# EAGLE design stepper control stm32 (EAGLE 9.6.2)
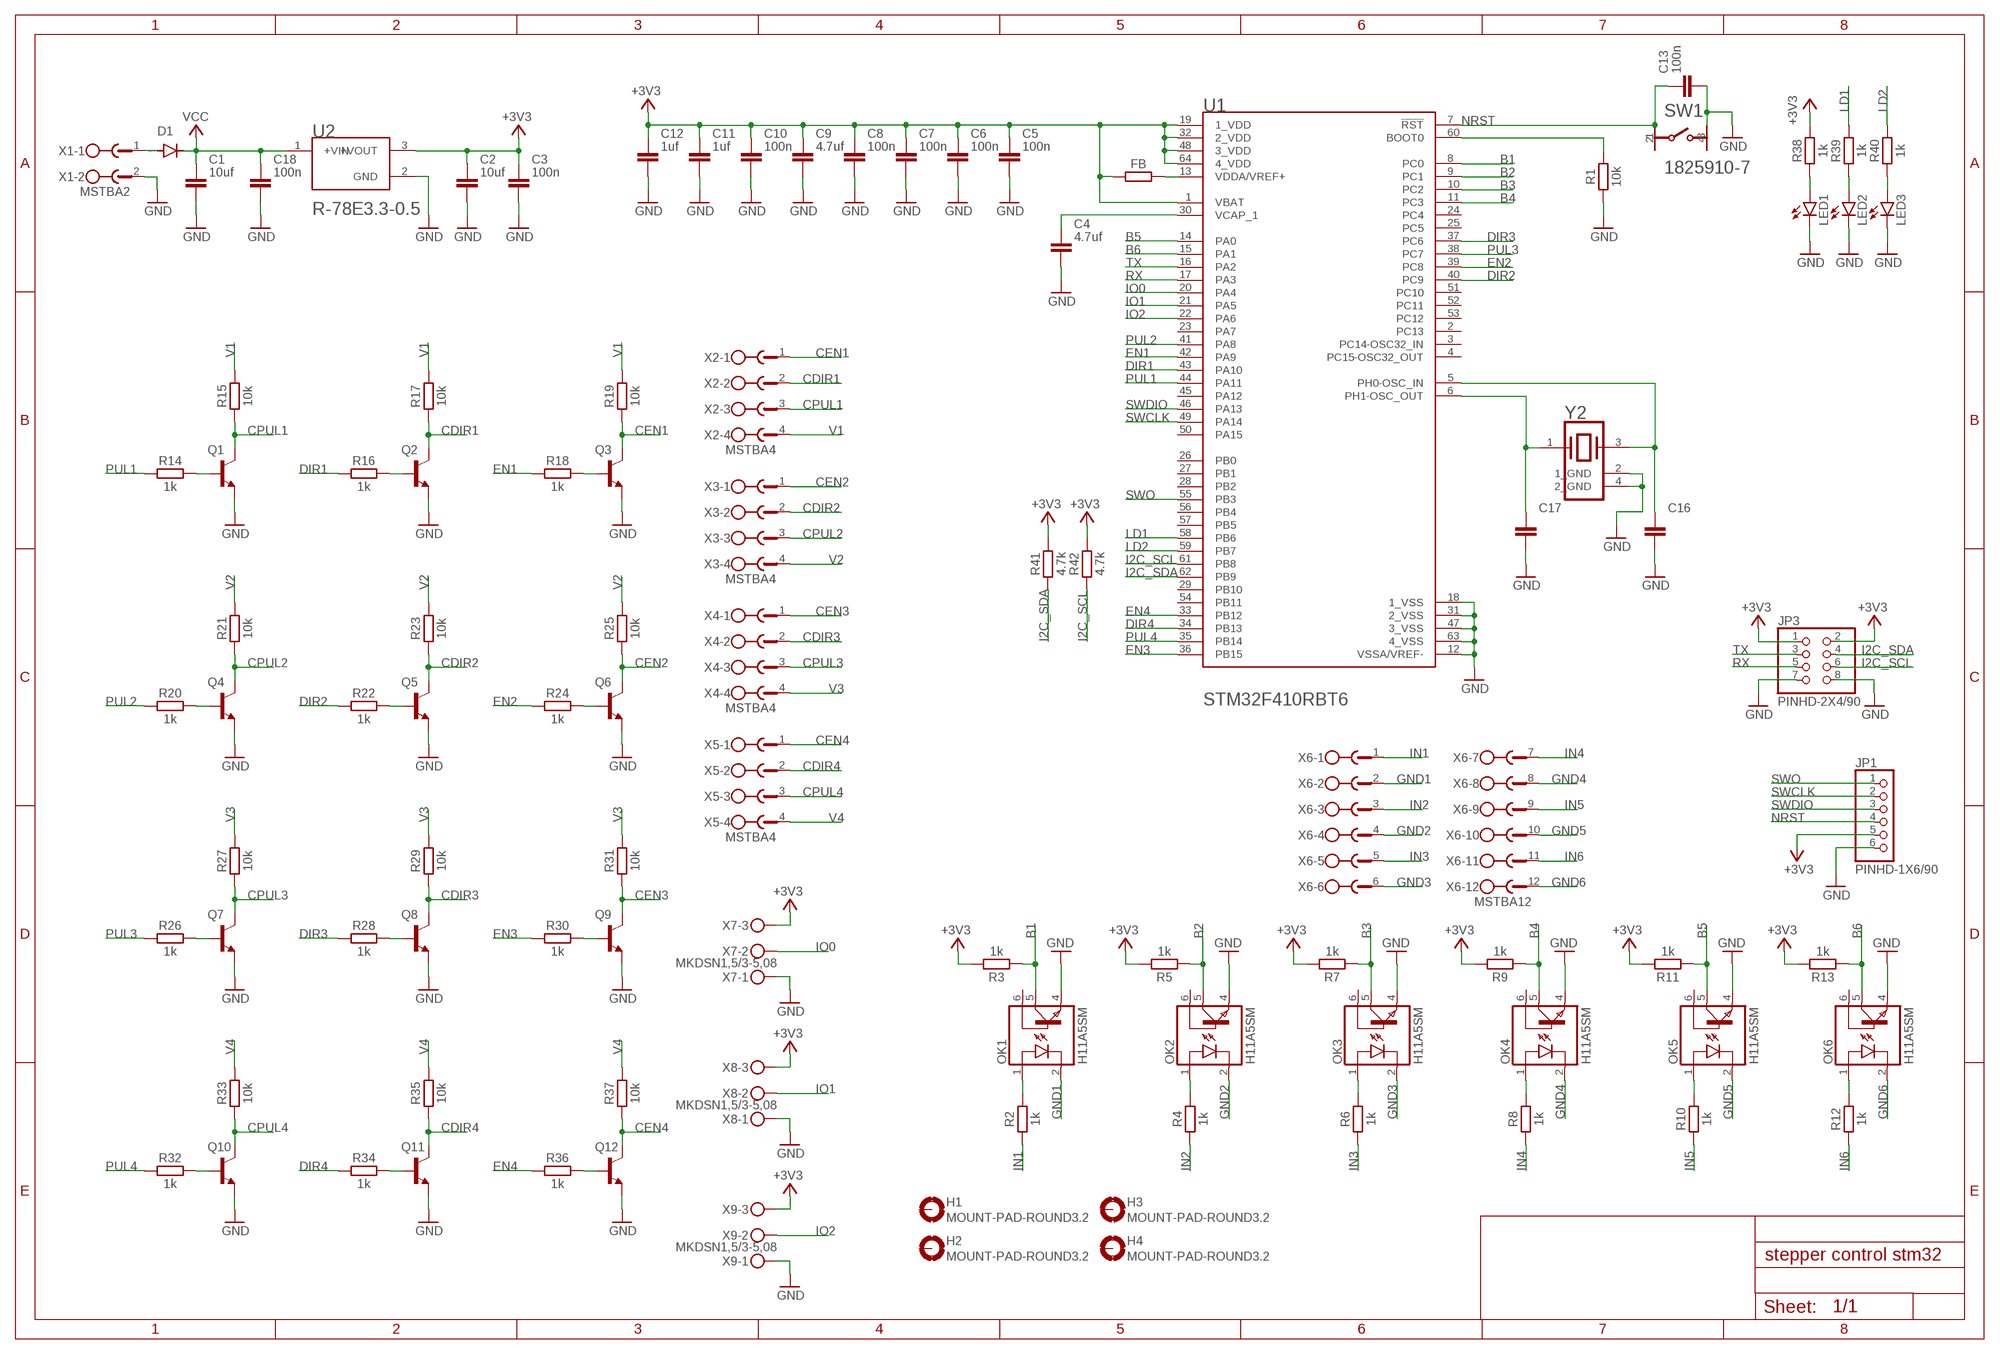
[diagram p0: schematic, sheet 1]

## Parts
C1  10uf  C_CHIP-0805(2012-METRIC)  [CAPC2012X110]
C2  10uf  C_CHIP-0805(2012-METRIC)  [CAPC2012X110]
C3  100n  C_CHIP-0603(1608-METRIC)  [CAPC1608X85]
C4  4.7uf  C_CHIP-1206(3216-METRIC)  [CAPC3216X135]
C5  100n  C_CHIP-0603(1608-METRIC)  [CAPC1608X85]
C6  100n  C_CHIP-0603(1608-METRIC)  [CAPC1608X85]
C7  100n  C_CHIP-0603(1608-METRIC)  [CAPC1608X85]
C8  100n  C_CHIP-0603(1608-METRIC)  [CAPC1608X85]
C9  4.7uf  C_CHIP-1206(3216-METRIC)  [CAPC3216X135]
C10  100n  C_CHIP-0603(1608-METRIC)  [CAPC1608X85]
C11  1uf  C_CHIP-0603(1608-METRIC)  [CAPC1608X85]
C12  1uf  C_CHIP-0603(1608-METRIC)  [CAPC1608X85]
C13  100n  C_CHIP-0603(1608-METRIC)  [CAPC1608X85]
C16  C_CHIP-0603(1608-METRIC)  [CAPC1608X85]
C17  C_CHIP-0603(1608-METRIC)  [CAPC1608X85]
C18  100n  C_CHIP-0603(1608-METRIC)  [CAPC1608X85]
D1  DIODE-SOD123  [SOD123]
FB  R_CHIP-0402(1005-METRIC)  [RESC1005X40]
H1  MOUNT-PAD-ROUND3.2  [3,2-PAD]
H2  MOUNT-PAD-ROUND3.2  [3,2-PAD]
H3  MOUNT-PAD-ROUND3.2  [3,2-PAD]
H4  MOUNT-PAD-ROUND3.2  [3,2-PAD]
JP1  PINHD-1X6/90  [1X06/90]
JP3  PINHD-2X4/90  [2X04/90]
LED1  LEDCHIPLED_0805  [CHIPLED_0805]
LED2  LEDCHIPLED_0805  [CHIPLED_0805]
LED3  LEDCHIPLED_0805  [CHIPLED_0805]
OK1  H11A5SM  [DIL6-SMD]
OK2  H11A5SM  [DIL6-SMD]
OK3  H11A5SM  [DIL6-SMD]
OK4  H11A5SM  [DIL6-SMD]
OK5  H11A5SM  [DIL6-SMD]
OK6  H11A5SM  [DIL6-SMD]
Q1  MMBT3904LT1G  [SOT23-3]
Q2  MMBT3904LT1G  [SOT23-3]
Q3  MMBT3904LT1G  [SOT23-3]
Q4  MMBT3904LT1G  [SOT23-3]
Q5  MMBT3904LT1G  [SOT23-3]
Q6  MMBT3904LT1G  [SOT23-3]
Q7  MMBT3904LT1G  [SOT23-3]
Q8  MMBT3904LT1G  [SOT23-3]
Q9  MMBT3904LT1G  [SOT23-3]
Q10  MMBT3904LT1G  [SOT23-3]
Q11  MMBT3904LT1G  [SOT23-3]
Q12  MMBT3904LT1G  [SOT23-3]
R1  10k  R_CHIP-0603(1608-METRIC)  [RESC1608X60]
R2  1k  R_CHIP-0603(1608-METRIC)  [RESC1608X60]
R3  1k  R_CHIP-0603(1608-METRIC)  [RESC1608X60]
R4  1k  R_CHIP-0603(1608-METRIC)  [RESC1608X60]
R5  1k  R_CHIP-0603(1608-METRIC)  [RESC1608X60]
R6  1k  R_CHIP-0603(1608-METRIC)  [RESC1608X60]
R7  1k  R_CHIP-0603(1608-METRIC)  [RESC1608X60]
R8  1k  R_CHIP-0603(1608-METRIC)  [RESC1608X60]
R9  1k  R_CHIP-0603(1608-METRIC)  [RESC1608X60]
R10  1k  R_CHIP-0603(1608-METRIC)  [RESC1608X60]
R11  1k  R_CHIP-0603(1608-METRIC)  [RESC1608X60]
R12  1k  R_CHIP-0603(1608-METRIC)  [RESC1608X60]
R13  1k  R_CHIP-0603(1608-METRIC)  [RESC1608X60]
R14  1k  R_CHIP-0603(1608-METRIC)  [RESC1608X60]
R15  10k  R_CHIP-0603(1608-METRIC)  [RESC1608X60]
R16  1k  R_CHIP-0603(1608-METRIC)  [RESC1608X60]
R17  10k  R_CHIP-0603(1608-METRIC)  [RESC1608X60]
R18  1k  R_CHIP-0603(1608-METRIC)  [RESC1608X60]
R19  10k  R_CHIP-0603(1608-METRIC)  [RESC1608X60]
R20  1k  R_CHIP-0603(1608-METRIC)  [RESC1608X60]
R21  10k  R_CHIP-0603(1608-METRIC)  [RESC1608X60]
R22  1k  R_CHIP-0603(1608-METRIC)  [RESC1608X60]
R23  10k  R_CHIP-0603(1608-METRIC)  [RESC1608X60]
R24  1k  R_CHIP-0603(1608-METRIC)  [RESC1608X60]
R25  10k  R_CHIP-0603(1608-METRIC)  [RESC1608X60]
R26  1k  R_CHIP-0603(1608-METRIC)  [RESC1608X60]
R27  10k  R_CHIP-0603(1608-METRIC)  [RESC1608X60]
R28  1k  R_CHIP-0603(1608-METRIC)  [RESC1608X60]
R29  10k  R_CHIP-0603(1608-METRIC)  [RESC1608X60]
R30  1k  R_CHIP-0603(1608-METRIC)  [RESC1608X60]
R31  10k  R_CHIP-0603(1608-METRIC)  [RESC1608X60]
R32  1k  R_CHIP-0603(1608-METRIC)  [RESC1608X60]
R33  10k  R_CHIP-0603(1608-METRIC)  [RESC1608X60]
R34  1k  R_CHIP-0603(1608-METRIC)  [RESC1608X60]
R35  10k  R_CHIP-0603(1608-METRIC)  [RESC1608X60]
R36  1k  R_CHIP-0603(1608-METRIC)  [RESC1608X60]
R37  10k  R_CHIP-0603(1608-METRIC)  [RESC1608X60]
R38  1k  R_CHIP-0603(1608-METRIC)  [RESC1608X60]
R39  1k  R_CHIP-0603(1608-METRIC)  [RESC1608X60]
R40  1k  R_CHIP-0603(1608-METRIC)  [RESC1608X60]
R41  4.7k  R_CHIP-0603(1608-METRIC)  [RESC1608X60]
R42  4.7k  R_CHIP-0603(1608-METRIC)  [RESC1608X60]
SW1  TE_1825910-7TE_1825910-7_0_0  [TE_1825910-7_0]
U1  STMICROELECTRONICS_STM32F410RBT6STMICROELECTRONICS_STM32F410RBT6_0_1  [STMICROELECTRONICS_STM32F410RBT6_1]
U2  RECOM_R-78E3.3-0.5RECOM_R-78E3.3-0.5_0_0  [RECOM_R-78E3.3-0.5_0]
X1  MSTBA2  [MSTBA2]
X2  MSTBA4  [MSTBA4]
X3  MSTBA4  [MSTBA4]
X4  MSTBA4  [MSTBA4]
X5  MSTBA4  [MSTBA4]
X6  MSTBA12  [MSTBA12]
X7  MKDSN1,5/3-5,08  [MKDSN1,5/3-5,08]
X8  MKDSN1,5/3-5,08  [MKDSN1,5/3-5,08]
X9  MKDSN1,5/3-5,08  [MKDSN1,5/3-5,08]
Y2  ABRACON_ABM8G-25.000MHZ-18-D2Y-TABRACON_ABM8G-25.000MHZ-18-D2Y-T_0_0  [ABRACON_ABM8G-25.000MHZ-18-D2Y-T_0]

## Nets
+3V3: C2.1 C3.1 C5.1 C6.1 C7.1 C8.1 C9.1 C10.1 C11.1 C12.1 FB.1 JP1.5 JP3.1 JP3.2 R3.2 R5.2 R7.2 R9.2 R11.2 R13.2 R38.2 R41.2 R42.2 U1.1(VBAT) U1.19(1_VDD) U1.32(2_VDD) U1.48(3_VDD) U1.64(4_VDD) U2.3(+VOUT) X7.3 X8.3 X9.3
B1: OK1.5(COL) R3.1 U1.8(PC0)
B2: OK2.5(COL) R5.1 U1.9(PC1)
B3: OK3.5(COL) R7.1 U1.10(PC2)
B4: OK4.5(COL) R9.1 U1.11(PC3)
B5: OK5.5(COL) R11.1 U1.14(PA0)
B6: OK6.5(COL) R13.1 U1.15(PA1)
CDIR1: Q2.3(C) R17.1 X2.2
CDIR2: Q5.3(C) R23.1 X3.2
CDIR3: Q8.3(C) R29.1 X4.2
CDIR4: Q11.3(C) R35.1 X5.2
CEN1: Q3.3(C) R19.1 X2.1
CEN2: Q6.3(C) R25.1 X3.1
CEN3: Q9.3(C) R31.1 X4.1
CEN4: Q12.3(C) R37.1 X5.1
CPUL1: Q1.3(C) R15.1 X2.3
CPUL2: Q4.3(C) R21.1 X3.3
CPUL3: Q7.3(C) R27.1 X4.3
CPUL4: Q10.3(C) R33.1 X5.3
DIR1: R16.1 U1.43(PA10)
DIR2: R22.1 U1.40(PC9)
DIR3: R28.1 U1.37(PC6)
DIR4: R34.1 U1.34(PB13)
EN1: R18.1 U1.42(PA9)
EN2: R24.1 U1.39(PC8)
EN3: R30.1 U1.36(PB15)
EN4: R36.1 U1.33(PB12)
GND: C1.2 C2.2 C3.2 C4.2 C5.2 C6.2 C7.2 C8.2 C9.2 C10.2 C11.2 C12.2 C13.2 C16.2 C17.2 C18.2 JP1.6 JP3.7 JP3.8 LED1.C LED2.C LED3.C OK1.4(EMI) OK2.4(EMI) OK3.4(EMI) OK4.4(EMI) OK5.4(EMI) OK6.4(EMI) Q1.2(E) Q2.2(E) Q3.2(E) Q4.2(E) Q5.2(E) Q6.2(E) Q7.2(E) Q8.2(E) Q9.2(E) Q10.2(E) Q11.2(E) Q12.2(E) R1.1 SW1.3 U1.12(VSSA/VREF-) U1.18(1_VSS) U1.31(2_VSS) U1.47(3_VSS) U1.63(4_VSS) U2.2(GND) X1.2 X7.1 X8.1 X9.1 Y2.2(1_GND) Y2.4(2_GND)
GND1: OK1.2(C) X6.2
GND2: OK2.2(C) X6.4
GND3: OK3.2(C) X6.6
GND4: OK4.2(C) X6.8
GND5: OK5.2(C) X6.10
GND6: OK6.2(C) X6.12
I2C_SCL: JP3.6 R42.1 U1.61(PB8)
I2C_SDA: JP3.4 R41.1 U1.62(PB9)
IN1: R2.1 X6.1
IN2: R4.1 X6.3
IN3: R6.1 X6.5
IN4: R8.1 X6.7
IN5: R10.1 X6.9
IN6: R12.1 X6.11
IO0: U1.20(PA4) X7.2
IO1: U1.21(PA5) X8.2
IO2: U1.22(PA6) X9.2
LD1: R39.2 U1.58(PB6)
LD2: R40.2 U1.59(PB7)
N$1: FB.2 U1.13(VDDA/VREF+)
N$2: C4.1 U1.30(VCAP_1)
N$4: R1.2 U1.60(BOOT0)
N$6: C16.1 U1.5(PH0-OSC_IN) Y2.3
N$7: C17.1 U1.6(PH1-OSC_OUT) Y2.1
N$8: OK1.1(A) R2.2
N$9: Q1.1(B) R14.2
N$10: LED3.A R40.1
N$11: LED2.A R39.1
N$12: OK2.1(A) R4.2
N$13: Q10.1(B) R32.2
N$14: Q2.1(B) R16.2
N$15: LED1.A R38.1
N$16: OK3.1(A) R6.2
N$17: D1.A X1.1
N$19: Q3.1(B) R18.2
N$20: OK4.1(A) R8.2
N$24: OK5.1(A) R10.2
N$25: Q4.1(B) R20.2
N$28: OK6.1(A) R12.2
N$30: Q5.1(B) R22.2
N$33: Q11.1(B) R34.2
N$34: Q6.1(B) R24.2
N$38: Q7.1(B) R26.2
N$42: Q8.1(B) R28.2
N$46: Q9.1(B) R30.2
N$49: Q12.1(B) R36.2
NRST: C13.1 JP1.4 SW1.1 U1.7(!RST!)
PUL1: R14.1 U1.44(PA11)
PUL2: R20.1 U1.41(PA8)
PUL3: R26.1 U1.38(PC7)
PUL4: R32.1 U1.35(PB14)
RX: JP3.5 U1.17(PA3)
SWCLK: JP1.2 U1.49(PA14)
SWDIO: JP1.3 U1.46(PA13)
SWO: JP1.1 U1.55(PB3)
TX: JP3.3 U1.16(PA2)
V1: R15.2 R17.2 R19.2 X2.4
V2: R21.2 R23.2 R25.2 X3.4
V3: R27.2 R29.2 R31.2 X4.4
V4: R33.2 R35.2 R37.2 X5.4
VCC: C1.1 C18.1 D1.C U2.1(+VIN)
Unconnected: H1.B3,2(MOUNT) H2.B3,2(MOUNT) H3.B3,2(MOUNT) H4.B3,2(MOUNT) OK1.6(BAS) OK2.6(BAS) OK3.6(BAS) OK4.6(BAS) OK5.6(BAS) OK6.6(BAS) SW1.2 SW1.4 U1.2(PC13) U1.3(PC14-OSC32_IN) U1.4(PC15-OSC32_OUT) U1.23(PA7) U1.24(PC4) U1.25(PC5) U1.26(PB0) U1.27(PB1) U1.28(PB2) U1.29(PB10) U1.45(PA12) U1.50(PA15) U1.51(PC10) U1.52(PC11) U1.53(PC12) U1.54(PB11) U1.56(PB4) U1.57(PB5)

## Library data of the parts
C1-C13 C16-C18 = Capacitor:C: Capacitor - Generic; CATEGORY: Capacitor
D1 = diode:DIODE-: DIODE
FB R1-R42 = Resistor:R: Resistor Fixed - Generic; CATEGORY: Resistor; SUB-CATEGORY: Fixed
H1-H4 = holes:MOUNT-PAD-ROUND: MOUNTING PAD, round
JP1 = Connector:PINHD-1X6: PIN HEADER; CATEGORY: CONNECTOR; SUB-CATEGORY: PIN-HEADER
JP3 = Connector:PINHD-2X4: PIN HEADER; CATEGORY: CONNECTOR; SUB-CATEGORY: PIN-HEADER
LED1-LED3 = led:LED: LED OSRAM: - CHIPLED LG R971, LG N971, LY N971, LG Q971, LY Q971, LO R971, LY R971 LH N974, LH R974 LS Q976, LO Q976, LY Q976 LO Q996 - Hyper CHIPLED LW Q18S LB Q993, LB Q99A, LB R99A - SideLED LS A670, LO A670, LY A670, LG A670, LP A670 LB A673, LV A673, LT A673, LW A673 LH A674 LY A675 LS A676, LA A676, LO A676, LY A676, LW A676 LS A679, LY A679, LG A679 - Hyper Micro SIDELED® LS Y876, LA Y876, LO Y876, LY Y876 LT Y87S - SmartLED LW L88C, LW L88S LB L89C, LB L89S, LG L890 LS L89K, LO L89K, LY L89K LS L896, LA L896, LO L896, LY L896 - TOPLED LS T670, LO T670, LY T670, LG T670, LP T670 LSG T670, LSP T670, LSY T670, LOP T670, LYG T670 LG T671, LOG T671, LSG T671 LB T673, LV T673, LT T673, LW T673 LH T674 LS T676, LA T676, LO T676, LY T676, LB T676, LH T676, LSB T676, LW T676 LB T67C, LV T67C, LT T67C, LS T67K, LO T67K, LY T67K, LW E67C LS E67B, LA E67B, LO E67B, LY E67B, LB E67C, LV E67C, LT E67C LW T67C LS T679, LY T679, LG T679 LS T770, LO T770, LY T770, LG T770, LP T770 LB T773, LV T773, LT T773, LW T773 LH T774 LS E675, LA E675, LY E675, LS T675 LS T776, LA T776, LO T776, LY T776, LB T776 LHGB T686 LT T68C, LB T68C - Hyper Mini TOPLED® LB M676 - Mini TOPLED Santana® LG M470 LS M47K, LO M47K, LY M47K Source: http://www.osram.convergy.de LUXEON: - LUMILED® LXK2-PW12-R00, LXK2-PW12-S00, LXK2-PW14-U00, LXK2-PW14-V00 LXK2-PM12-R00, LXK2-PM12-S00, LXK2-PM14-U00 LXK2-PE12-Q00, LXK2-PE12-R00, LXK2-PE12-S00, LXK2-PE14-T00, LXK2-PE14-U00 LXK2-PB12-K00, LXK2-PB12-L00, LXK2-PB12-M00, LXK2-PB14-N00, LXK2-PB14-P00, LXK2-PB14-Q00 LXK2-PR12-L00, LXK2-PR12-M00, LXK2-PR14-Q00, LXK2-PR14-R00 LXK2-PD12-Q00, LXK2-PD12-R00, LXK2-PD12-S00 LXK2-PH12-R00, LXK2-PH12-S00 LXK2-PL12-P00, LXK2-PL12-Q00, LXK2-PL12-R00 Source: www.luxeon.com KINGBRIGHT: KA-3528ASYC Source: www.kingbright.com
OK1-OK6 = optocoupler:H11A*?M: General Purpose 6-Pin Phototransistor Optocouplers Source: http://www.fairchildsemi.com/ds/4N/4N35-M.pdf; OC_FARNELL: unknown; OC_NEWARK: unknown
Q1-Q12 = Transistor:MMBT3904LT1G: TRANS NPN 40V 0.2A SOT23 Manufacturer's datasheet <https://www.onsemi.com/pub/Collateral/MMBT3904LT1-D.PDF>; CREATED_BY: PCBLayout.com; DIGIKEY_PART_NUMBER: MMBT3904LT1GOSTR-ND; MANUFACTURER: ON Semiconductor; MPN: MMBT3904LT1G; PACKAGE: SOT23-3
SW1 = TE - 1825910-7:TE_1825910-7: 6 MM TACT SWITCH, THRU-HOLE HIGH TEMP; ACTUATOR_HEIGHT_OFF_PCB,_VERTICAL: 5.00mm; ACTUATOR_MATERIAL: Polybutylene Terephthalate (PBT); ACTUATOR_ORIENTATION: Top Actuated; ACTUATOR_TYPE: Standard; CENTROID_NOT_SPECIFIED: No; CIRCUIT: SPST-NO; CONTACT_RATING_@_VOLTAGE: 0.05A @ 24VDC; DATASHEET: http://www.te.com/commerce/DocumentDelivery/DDEController?Action=srchrtrv&DocNm=1825910&DocType=Customer+Drawing&DocLang=English; DIGIKEY_DESCRIPTION: SWITCH Tactile Switch SPST-NO Top Actuated Through Hole; DIGIKEY_PART_NUMBER: 450-1804-ND; ILLUMINATION: Non-Illuminated; LEAD_FREE: yes; MECHANICAL_LIFE: 100,000 Cycles; MF: TE; MOUNTING_TYPE: Through Hole; MOUSER_PART_NUMBER: 506-FSM4JAH; MPN: 1825910-7; OPERATING_FORCE: 260gf; OUTLINE: 6.00mm x 6.00mm; PACKAGE: Through Hole; PREFIX: SW; ROHS: yes; SWITCH_FUNCTION: Off-Mom; SWITCH_TRAVEL: 0.25mm; TEMPERATURE_RANGE_HIGH: +85°C; TEMPERATURE_RANGE_LOW: -35°C; TERMINATION_STYLE: PC Pin
U1 = STMicroelectronics - STM32F410RBT6:STMICROELECTRONICS_STM32F410RBT6: IC MCU 32BIT 128KB FLASH 64LQFP; AMBIENT_TEMPERATURE_RANGE_HIGH: +85°C; AMBIENT_TEMPERATURE_RANGE_LOW: -40°C; AUTOMOTIVE: No; CENTROID_NOT_SPECIFIED: No; CORE_ARCHITECTURE: ARM Cortex-M4; DATASHEET: https://www.st.com/resource/en/datasheet/stm32f410rb.pdf; DATA_BUS_WIDTH: 32bits; DEVICE_CLASS_L1: Integrated Circuits (ICs); DEVICE_CLASS_L2: Embedded Processors and Controllers; DEVICE_CLASS_L3: Microcontrollers; DIGIKEY_DESCRIPTION: IC MCU 32BIT 128KB FLASH 64LQFP; DIGIKEY_PART_NUMBER: 497-16239-ND; FOOTPRINT_PARAMETERS_1: {"fp_type":"TQFP","params":{"N1":{"nom":16,"long name":"Leads on long side","min":null,"max":null,"short name":"N1","type":"count"},"N2":{"nom":16,"long name":"Leads on wide side","min":null,"max":null,"short name":"N2","type":"count"},"A":{"nom":false,"long name":"Height","min":false,"max":1600000,"short name":"A","type":"measurement"},"A1":{"nom":false,"long name":"Package clearance","min":50000,"max":150000,"short name":"A1","type":"measurement"},"A2":{"nom":1400000,"long name":"Package height","min":1350000,"max":1450000,"short name":"A2","type":"measurement"},"D":{"nom":12000000,"long name":"Length /w leads","min":false,"max":false,"short name":"D","type":"measurement"},"D1":{"nom":10000000,"long name":"Package length","min":false,"max":false,"short name":"D1","type":"measurement"},"E":{"nom":12000000,"long name":"Width /w leads","min":false,"max":false,"short name":"E","type":"measurement"},"E1":{"nom":10000000,"long name":"Package width","min":false,"max":false,"short name":"E1","type":"measurement"},"B":{"nom":220000,"long name":"Lead width","min":170000,"max":270000,"short name":"B","type":"measurement"},"C":{"nom":false,"long name":"Lead thickness","min":90000,"max":200000,"short name":"C","type":"measurement"},"L":{"nom":600000,"long name":"Lead foot length","min":450000,"max":750000,"short name":"L","type":"measurement"},"e":{"nom":500000,"long name":"Lead pitch","min":null,"max":null,"short name":"e","type":"measurement"},"PHI":{"nom":false,"long name":"Lead angle","min":0,"max":7000000,"short name":"PHI","type":"measurement"},"HT":{"default":"No","long name":"Thermal pad","type":"multichoiceparent","short name":"HT","children":[]},"offset x":{"nom":0,"long name":"X Center offset","min":null,"max":null,"short name":"offset x","type":"measurement"},"offset y":{"nom":0,"long name":"Y Center offset","min":null,"max":null,"short name":"offset y","type":"measurement"},"LS":{"default":"Rounded rectangle","long name":"Land shape","type":"multichoice","short name":"LS"},"LS1":{"default":"Rectangle","long name":"Land shape (Pin 1)","type":"multichoice","short name":"LS1"},"solder toe":{"nom":550000,"long name":"Solder fillet (toe)","min":null,"max":null,"short name":"solder toe","type":"fixedmeasurement"},"solder heel":{"nom":450000,"long name":"Solder fillet (heel)","min":null,"max":null,"short name":"solder heel","type":"fixedmeasurement"},"solder side":{"nom":10000,"long name":"Solder fillet (side)","min":null,"max":null,"short name":"solder side","type":"fixedmeasurement"},"courtyard":{"nom":500000,"long name":"Courtyard","min":null,"max":null,"short name":"courtyard","type":"fixedmeasurement"},"SF":{"default":"A (<= 0.625mm pitch)","long name":"Packing level","type":"multichoiceparent","short name":"SF","help":"http://support.upverter.com/customer/portal/articles/978783-what-is-a-footprint-packing-level","children":["solder toe","solder heel","solder side","courtyard"]}}}; FOOTPRINT_PARAMETERS_2: {"fp_type":"TQFP","params":{"N1":{"nom":16,"long name":"Leads on long side","min":null,"max":null,"short name":"N1","type":"count"},"N2":{"nom":16,"long name":"Leads on wide side","min":null,"max":null,"short name":"N2","type":"count"},"A":{"nom":false,"long name":"Height","min":false,"max":1600000,"short name":"A","type":"measurement"},"A1":{"nom":false,"long name":"Package clearance","min":50000,"max":150000,"short name":"A1","type":"measurement"},"A2":{"nom":1400000,"long name":"Package height","min":1350000,"max":1450000,"short name":"A2","type":"measurement"},"D":{"nom":12000000,"long name":"Length /w leads","min":false,"max":false,"short name":"D","type":"measurement"},"D1":{"nom":10000000,"long name":"Package length","min":false,"max":false,"short name":"D1","type":"measurement"},"E":{"nom":12000000,"long name":"Width /w leads","min":false,"max":false,"short name":"E","type":"measurement"},"E1":{"nom":10000000,"long name":"Package width","min":false,"max":false,"short name":"E1","type":"measurement"},"B":{"nom":220000,"long name":"Lead width","min":170000,"max":270000,"short name":"B","type":"measurement"},"C":{"nom":false,"long name":"Lead thickness","min":90000,"max":200000,"short name":"C","type":"measurement"},"L":{"nom":600000,"long name":"Lead foot length","min":450000,"max":750000,"short name":"L","type":"measurement"},"e":{"nom":500000,"long name":"Lead pitch","min":null,"max":null,"short name":"e","type":"measurement"},"PHI":{"nom":false,"long name":"Lead angle","min":0,"max":7000000,"short name":"PHI","type":"measurement"},"HT":{"default":"No","long name":"Thermal pad","type":"multichoiceparent","short name":"HT","children":[]},"offset x":{"nom":0,"long name":"X Center offset","min":null,"max":null,"short name":"offset x","type":"measurement"},"offset y":{"nom":0,"long name":"Y Center offset","min":null,"max":null,"short name":"offset y","type":"measurement"},"LS":{"default":"Rounded rectangle","long name":"Land shape","type":"multichoice","short name":"LS"},"LS1":{"default":"Rectangle","long name":"Land shape (Pin 1)","type":"multichoice","short name":"LS1"},"solder toe":{"nom":350000,"long name":"Solder fillet (toe)","min":null,"max":null,"short name":"solder toe","type":"fixedmeasurement"},"solder heel":{"nom":350000,"long name":"Solder fillet (heel)","min":null,"max":null,"short name":"solder heel","type":"fixedmeasurement"},"solder side":{"nom":-20000,"long name":"Solder fillet (side)","min":null,"max":null,"short name":"solder side","type":"fixedmeasurement"},"courtyard":{"nom":250000,"long name":"Courtyard","min":null,"max":null,"short name":"courtyard","type":"fixedmeasurement"},"SF":{"default":"B (<= 0.625mm pitch)","long name":"Packing level","type":"multichoiceparent","short name":"SF","help":"http://support.upverter.com/customer/portal/articles/978783-what-is-a-footprint-packing-level","children":["solder toe","solder heel","solder side","courtyard"]}}}; FOOTPRINT_PARAMETERS_3: {"fp_type":"TQFP","params":{"N1":{"nom":16,"long name":"Leads on long side","min":null,"max":null,"short name":"N1","type":"count"},"N2":{"nom":16,"long name":"Leads on wide side","min":null,"max":null,"short name":"N2","type":"count"},"A":{"nom":false,"long name":"Height","min":false,"max":1600000,"short name":"A","type":"measurement"},"A1":{"nom":false,"long name":"Package clearance","min":50000,"max":150000,"short name":"A1","type":"measurement"},"A2":{"nom":1400000,"long name":"Package height","min":1350000,"max":1450000,"short name":"A2","type":"measurement"},"D":{"nom":12000000,"long name":"Length /w leads","min":false,"max":false,"short name":"D","type":"measurement"},"D1":{"nom":10000000,"long name":"Package length","min":false,"max":false,"short name":"D1","type":"measurement"},"E":{"nom":12000000,"long name":"Width /w leads","min":false,"max":false,"short name":"E","type":"measurement"},"E1":{"nom":10000000,"long name":"Package width","min":false,"max":false,"short name":"E1","type":"measurement"},"B":{"nom":220000,"long name":"Lead width","min":170000,"max":270000,"short name":"B","type":"measurement"},"C":{"nom":false,"long name":"Lead thickness","min":90000,"max":200000,"short name":"C","type":"measurement"},"L":{"nom":600000,"long name":"Lead foot length","min":450000,"max":750000,"short name":"L","type":"measurement"},"e":{"nom":500000,"long name":"Lead pitch","min":null,"max":null,"short name":"e","type":"measurement"},"PHI":{"nom":false,"long name":"Lead angle","min":0,"max":7000000,"short name":"PHI","type":"measurement"},"HT":{"default":"No","long name":"Thermal pad","type":"multichoiceparent","short name":"HT","children":[]},"offset x":{"nom":0,"long name":"X Center offset","min":null,"max":null,"short name":"offset x","type":"measurement"},"offset y":{"nom":0,"long name":"Y Center offset","min":null,"max":null,"short name":"offset y","type":"measurement"},"LS":{"default":"Rounded rectangle","long name":"Land shape","type":"multichoice","short name":"LS"},"LS1":{"default":"Rectangle","long name":"Land shape (Pin 1)","type":"multichoice","short name":"LS1"},"solder toe":{"nom":150000,"long name":"Solder fillet (toe)","min":null,"max":null,"short name":"solder toe","type":"fixedmeasurement"},"solder heel":{"nom":250000,"long name":"Solder fillet (heel)","min":null,"max":null,"short name":"solder heel","type":"fixedmeasurement"},"solder side":{"nom":-40000,"long name":"Solder fillet (side)","min":null,"max":null,"short name":"solder side","type":"fixedmeasurement"},"courtyard":{"nom":100000,"long name":"Courtyard","min":null,"max":null,"short name":"courtyard","type":"fixedmeasurement"},"SF":{"default":"C (<= 0.625mm pitch)","long name":"Packing level","type":"multichoiceparent","short name":"SF","help":"http://support.upverter.com/customer/portal/articles/978783-what-is-a-footprint-packing-level","children":["solder toe","solder heel","solder side","courtyard"]}}}; FOOTPRINT_VARIANT_NAME_0: Recommended_Land_Pattern; FOOTPRINT_VARIANT_NAME_1: IPC_A; FOOTPRINT_VARIANT_NAME_2: IPC_B; FOOTPRINT_VARIANT_NAME_3: IPC_C; FREQUENCY: 100MHz; HEIGHT: 1.6mm; INTERFACE: I2C,SPI,USART,I2S; IPC_LAND_PATTERN_NAME: QFP50P1200X1200X160-64; LEAD_FREE: Yes; MAX_JUNCTION_TEMP: +105°C; MAX_SUPPLY_VOLTAGE: 3.6V; MEMORY_SIZE: 128KBytes; MEMORY_TYPE: FLASH; MF: STMicroelectronics; MFG_PACKAGE_IDENT: LQFP64-5W; MFG_PACKAGE_IDENT_DATE: 0; MFG_PACKAGE_IDENT_REV: 3; MIN_SUPPLY_VOLTAGE: 1.8V; MOUSER_DESCRIPTION: ARM-Based 32-Bit MCU+FPU, 125 DMIPS, 128kB Flash, 32kB RAM, 64-pin LQFP, Tray; MOUSER_PART_NUMBER: 511-STM32F410RBT6; MPN: STM32F410RBT6; NOMINAL_SUPPLY_CURRENT: 0.8-27.1mA; NUMBER_OF_A/D_CONVERTERS: 1; NUMBER_OF_ADC_CHANNELS: 16; NUMBER_OF_CORES: 1; NUMBER_OF_I/OS: 50; NUMBER_OF_I2C_CHANNELS: 3; NUMBER_OF_PWM_CHANNELS: 1; NUMBER_OF_SPI_CHANNELS: 3; NUMBER_OF_TIMERS/COUNTERS: 7; NUMBER_OF_UART_CHANNELS: 3; PACKAGE: LQFP64; PREFIX: U; RAM_SIZE: 32KBytes; ROHS: Yes; STANDOFF_HEIGHT: 0.05mm; TEMPERATURE_RANGE_HIGH: +85°C; TEMPERATURE_RANGE_LOW: -40°C; VERIFICATION_VERSION: 0.0.0.3
U2 = RECOM - R-78E3.3-0.5:RECOM_R-78E3.3-0.5: DC/DC Converter; CENTROID_NOT_SPECIFIED: No; CURRENT_-_OUTPUT: 500mA; DATASHEET: https://www.recom-power.com/pdf/Innoline/R-78Exx-0.5.pdf; DIGIKEY_DESCRIPTION: IC Linear Regulator Replacement DC DC Converter 1 Output 3.3V 500mA 6V - 28V Input; DIGIKEY_PART_NUMBER: 945-1661-5-ND; EFFICIENCY: 88%; LEAD_FREE: yes; MF: RECOM; MOUSER_PART_NUMBER: 919-R-78E3.3-0.5; MPN: R-78E3.3-0.5; PACKAGE: PTH_11MM6_8MM5; POWER: 2W; PREFIX: U; ROHS: yes; TEMPERATURE_RANGE_HIGH: +85°C; TEMPERATURE_RANGE_LOW: -40°C; VOLTAGE_-_INPUT_(MAX): 28V; VOLTAGE_-_INPUT_(MIN): 6V; VOLTAGE_-_OUTPUT: 3.3V
X1 = con-phoenix-508:MSTBA2: PHOENIX; MF: FARNELL; MPN: 1757242; OC_FARNELL: 3705171; OC_NEWARK: 71C4161
X2-X5 = con-phoenix-508:MSTBA4: PHOENIX; MF: FARNELL; MPN: 1757268; OC_FARNELL: 3705195; OC_NEWARK: 71C4163
X6 = con-phoenix-508:MSTBA12: PHOENIX; MPN: 1757349; OC_FARNELL: 3705250; OC_NEWARK: 71C4169
X7-X9 = con-phoenix-508:MKDSN1,5/3-5,08: MKDSN 1,5/ 3-5,08 Printklemme Nennstrom: 13,5 A Nennspannung: 250 V Rastermaß: 5,08 mm Polzahl: 3 Anschlussart: Schraubanschluss Montage: Löten Anschlussrichtung Leiter/Platine: 0 ° Artikelnummer: 1729131 Source: http://eshop.phoenixcontact.com .. 1729131.pdf
Y2 = Abracon - ABM8G-25.000MHZ-18-D2Y-T:ABRACON_ABM8G-25.000MHZ-18-D2Y-T: 25MHz ±20ppm Crystal 18pF 60 Ohms 4-SMD, No Lead; AUTOMOTIVE: No; CENTROID_NOT_SPECIFIED: No; DATASHEET: https://abracon.com/Resonators/ABM8G.pdf; DEVICE_CLASS_L1: Passive Components; DEVICE_CLASS_L2: Crystals / Oscillators; DEVICE_CLASS_L3: Crystals; DIGIKEY_DESCRIPTION: CRYSTAL 25.0000MHZ 18PF SMD; DIGIKEY_PART_NUMBER: 535-10275-1-ND; ESR: 60Ω; FOOTPRINT_VARIANT_NAME_0: Recommended_Land_Pattern; FREQUENCY: 25MHz; HEIGHT: 1mm; LEAD_FREE: Yes; LOAD_CAPACITANCE: 18pF; MF: Abracon; MFG_PACKAGE_IDENT: ABM8G; MFG_PACKAGE_IDENT_DATE: 0; MFG_PACKAGE_IDENT_REV: 0; MOUSER_DESCRIPTION: Crystals 25.000MHz 18pF 30ppm -40C +85C; MOUSER_PART_NUMBER: 815-ABM8G-25-18D2Y; MPN: ABM8G-25.000MHZ-18-D2Y-T; NUM_PINS: 4; OCTOPART_PART_NUMBER: 571d9ed61f8188da; PACKAGE: SMT_3MM2_2MM5; PREFIX: Y; ROHS: Yes; SERIES: ABM8G; STABILITY: 30ppm; TEMPERATURE_RANGE_HIGH: +85°C; TEMPERATURE_RANGE_LOW: -40°C; TOLERANCE: 20ppm; VERIFICATION_VERSION: 0.0.0.3

## Board
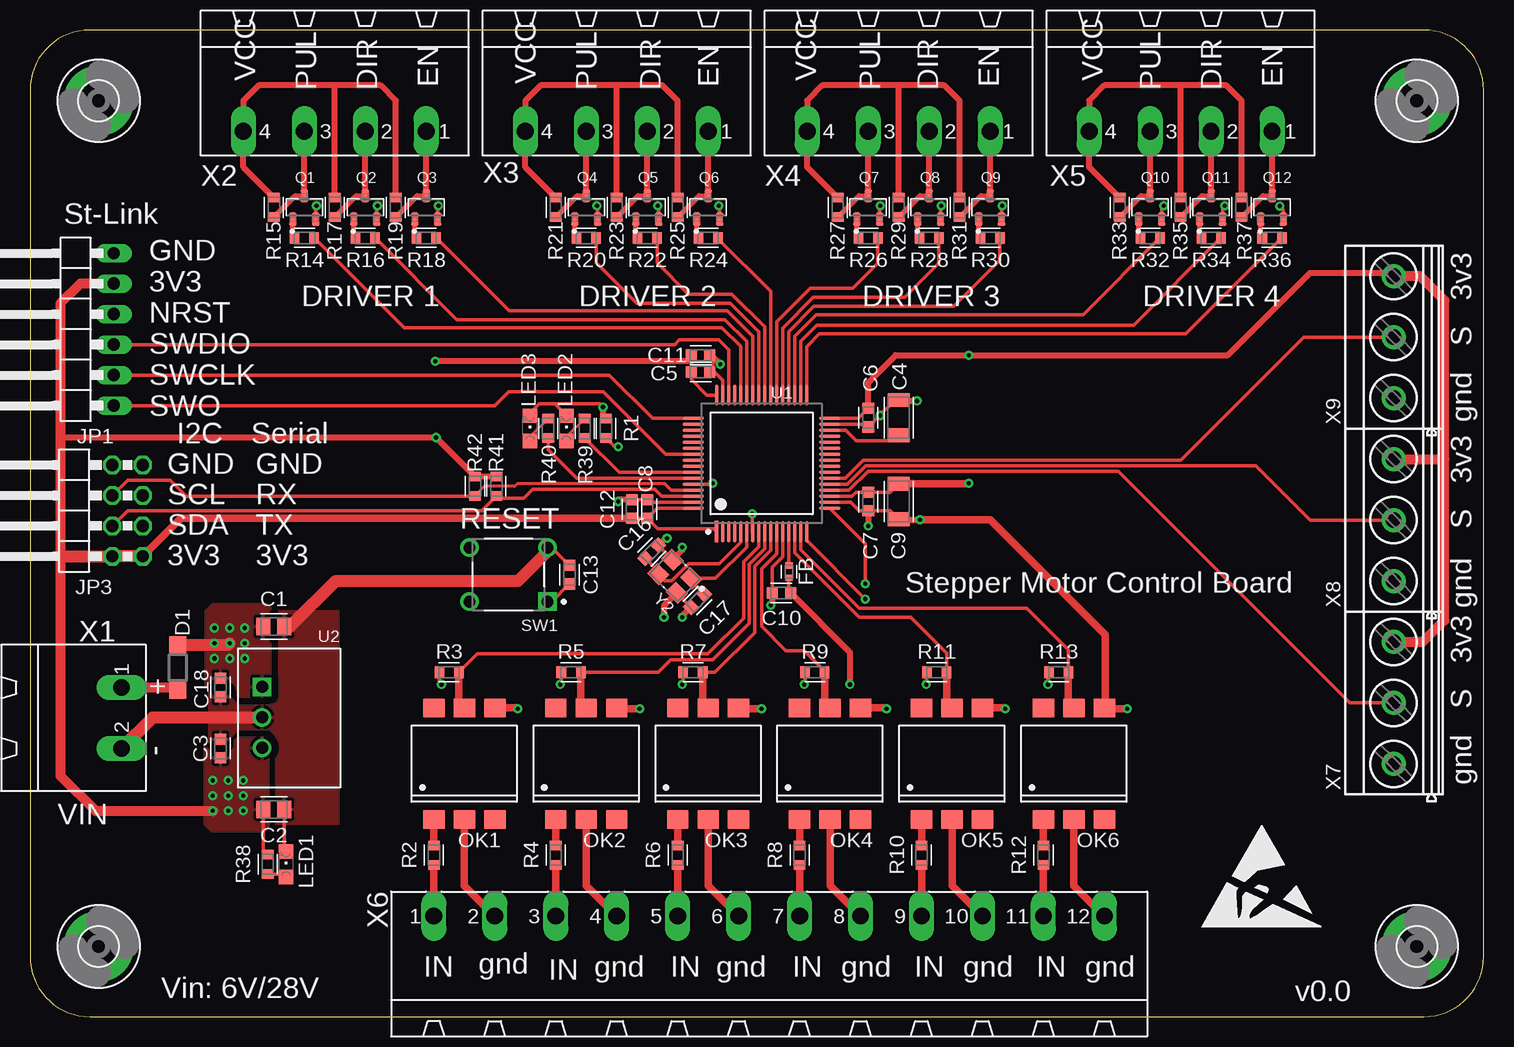
[diagram p1: board, top side]
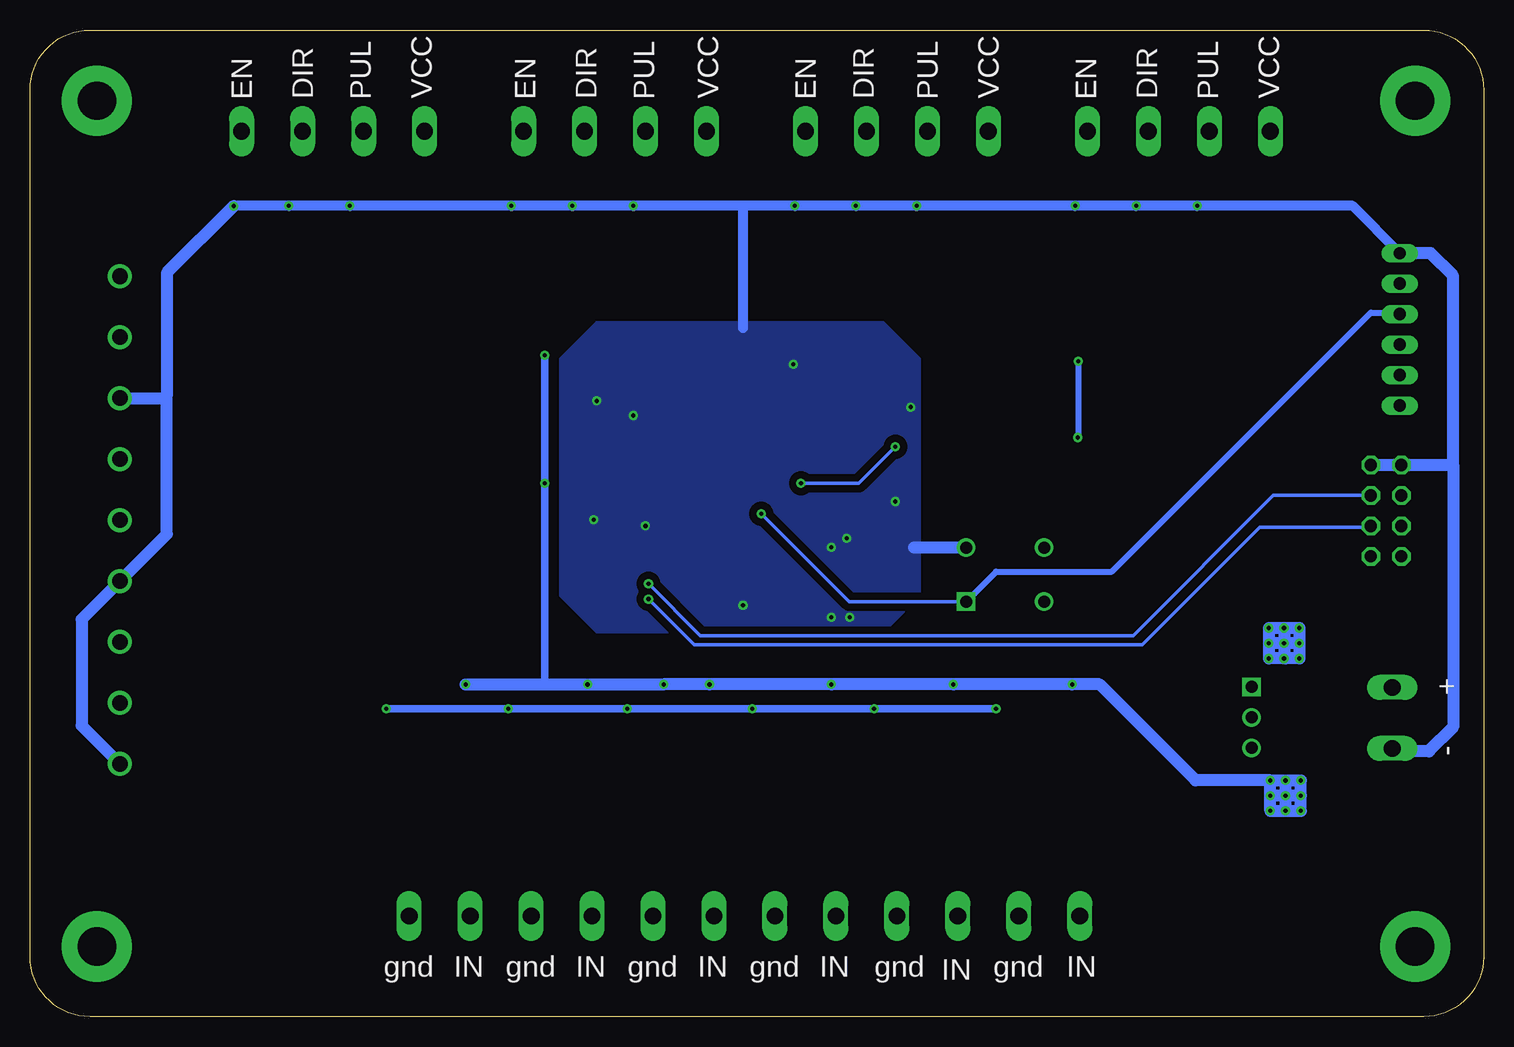
[diagram p2: board, bottom side, seen from below]

Size 121.14 x 82.22 mm. Coordinates in mm from the lower left corner, seen from the top.
Outline: 5,0 116.14,0 arc90 121.14,5 121.14,77.22 arc90 116.14,82.22 5,82.22 arc90 0,77.22 0,5 arc90 5,0
Copper layers (1*16): Top 0.035mm / dielectric 1.5mm / Bottom 0.035mm
Design rules "default": minimum track width 6mil, minimum drill 0.35mm, track to track 6mil, track to pad 6mil, pad to pad 6mil, via to via 6mil, smd to smd 6mil, copper to edge 40mil, drill to drill 6mil, minimum pad ring 10mil, minimum via ring 8mil, stop-mask expansion 4mil, vias tented up to drill 0mil, thermal gap 10mil

### Footprints (pad centres in the part's own frame; a part is rotated, then mirrored left to right if it is on the bottom)
CAPC2012X110 = smd 1.165 x 1.465: 1 -0.875,0; 2 0.875,0
CAPC1608X85 = smd 0.921 x 0.97: 1 -0.775,0; 2 0.775,0
CAPC3216X135 = smd 1.165 x 1.815: 1 -1.475,0; 2 1.475,0
SOD123 = smd 1.4 x 1.4: A 1.9,0; C -1.9,0
RESC1005X40 = smd 0.535 x 0.644: 1 -0.507,0; 2 0.507,0
3,2-PAD = drill 3.2 pad 5.842: B3,2 0,0
1X06/90 = drill 1.016 long: 1 -6.35,-3.81; 2 -3.81,-3.81; 3 -1.27,-3.81; 4 1.27,-3.81; 5 3.81,-3.81; 6 6.35,-3.81
2X04/90 = drill 1.016 octagon: 1 -3.81,-6.35; 2 -3.81,-3.81; 3 -1.27,-6.35; 4 -1.27,-3.81; 5 1.27,-6.35; 6 1.27,-3.81; 7 3.81,-6.35; 8 3.81,-3.81
CHIPLED_0805 = smd 1.2 x 1.2: A 0,-1.05; C 0,1.05
DIL6-SMD = smd 1.78 x 1.52: 1 -2.54,-4.645; 2 0,-4.645; 3 2.54,-4.645; 4 2.54,4.645; 5 0,4.645; 6 -2.54,4.645
SOT23-3 = smd 0.62 x 1.1: 1 -0.95,-0.975; 2 0.95,-0.975; 3 0,0.975
RESC1608X60 = smd 0.799 x 0.974: 1 -0.815,0; 2 0.815,0
TE_1825910-7_0 = drill 0.99 pad 1.54 square: 1 -3.25,2.25 | drill 0.99 pad 1.54: 2 3.25,2.25; 3 -3.25,-2.25; 4 3.25,-2.25
STMICROELECTRONICS_STM32F410RBT6_1 = smd 1.788 x 0.312: 1 -5.691,3.75; 2 -5.691,3.25; 3 -5.691,2.75; 4 -5.691,2.25; 5 -5.691,1.75; 6 -5.691,1.25; 7 -5.691,0.75; 8 -5.691,0.25; 9 -5.691,-0.25; 10 -5.691,-0.75; 11 -5.691,-1.25; 12 -5.691,-1.75; 13 -5.691,-2.25; 14 -5.691,-2.75; 15 -5.691,-3.25; 16 -5.691,-3.75; 33 5.691,-3.75; 34 5.691,-3.25; 35 5.691,-2.75; 36 5.691,-2.25; 37 5.691,-1.75; 38 5.691,-1.25; 39 5.691,-0.75; 40 5.691,-0.25; 41 5.691,0.25; 42 5.691,0.75; 43 5.691,1.25; 44 5.691,1.75; 45 5.691,2.25; 46 5.691,2.75; 47 5.691,3.25; 48 5.691,3.75 | smd 0.312 x 1.788: 17 -3.75,-5.691; 18 -3.25,-5.691; 19 -2.75,-5.691; 20 -2.25,-5.691; 21 -1.75,-5.691; 22 -1.25,-5.691; 23 -0.75,-5.691; 24 -0.25,-5.691; 25 0.25,-5.691; 26 0.75,-5.691; 27 1.25,-5.691; 28 1.75,-5.691; 29 2.25,-5.691; 30 2.75,-5.691; 31 3.25,-5.691; 32 3.75,-5.691; 49 3.75,5.691; 50 3.25,5.691; 51 2.75,5.691; 52 2.25,5.691; 53 1.75,5.691; 54 1.25,5.691; 55 0.75,5.691; 56 0.25,5.691; 57 -0.25,5.691; 58 -0.75,5.691; 59 -1.25,5.691; 60 -1.75,5.691; 61 -2.25,5.691; 62 -2.75,5.691; 63 -3.25,5.691; 64 -3.75,5.691
RECOM_R-78E3.3-0.5_0 = drill 1 pad 1.55 square: 1 -2.59,-2.25 | drill 1 pad 1.55: 2 -0.05,-2.25; 3 2.49,-2.25
MSTBA2 = drill 1.397 long: 1 -2.54,5.08; 2 2.54,5.08
MSTBA4 = drill 1.397 long: 1 -7.62,5.08; 2 -2.54,5.08; 3 2.54,5.08; 4 7.62,5.08
MSTBA12 = drill 1.397 long: 1 -27.94,5.08; 2 -22.86,5.08; 3 -17.78,5.08; 4 -12.7,5.08; 5 -7.62,5.08; 6 -2.54,5.08; 7 2.54,5.08; 8 7.62,5.08; 9 12.7,5.08; 10 17.78,5.08; 11 22.86,5.08; 12 27.94,5.08
MKDSN1,5/3-5,08 = drill 1.3 pad 2: 1 -7.641,0.025; 2 -2.561,0.025; 3 2.519,0.025
ABRACON_ABM8G-25.000MHZ-18-D2Y-T_0 = smd 1.4 x 1.2: 1 -1.1,-0.85; 2 1.1,-0.85; 3 1.1,0.85; 4 -1.1,0.85

### Placement (x,y rotation side)
C1  20.32,32.51 0 top
C2  20.32,17.27 0 top
C3  15.88,22.35 90 top
C4  72.39,49.91 90 top
C5  55.88,53.72 0 top
C6  69.85,49.91 270 top
C7  69.85,42.93 270 top
C8  51.44,42.29 90 top
C9  72.39,42.93 270 top
C10  62.61,35.31 180 top
C11  55.88,55.12 0 top
C12  50.16,42.29 90 top
C13  44.96,36.83 90 top
C16  51.82,38.73 45 top
C17  55.63,34.67 225 top
C18  15.88,27.43 270 top
D1  12.32,29.08 270 top
FB  63.25,37.08 90 top
H1  5.71,76.33 0 top
H2  5.71,5.84 0 top
H3  115.57,76.33 0 top
H4  115.57,5.84 0 top
JP1  3.17,57.28 90 top
JP3  3.05,42.16 90 top
LED1  21.34,12.7 0 top
LED2  44.7,49.02 0 top
LED3  41.66,49.02 0 top
OK1  36.2,21.08 0 top
OK2  46.35,21.08 0 top
OK3  56.52,21.08 0 top
OK4  66.67,21.08 0 top
OK5  76.83,21.08 0 top
OK6  87,21.08 0 top
Q1  22.86,67.44 0 top
Q2  27.94,67.44 0 top
Q3  33.02,67.44 0 top
Q4  46.35,67.44 0 top
Q5  51.44,67.44 0 top
Q6  56.52,67.44 0 top
Q7  69.85,67.44 0 top
Q8  74.93,67.44 0 top
Q9  80.01,67.44 0 top
Q10  93.34,67.44 0 top
Q11  98.42,67.44 0 top
Q12  103.5,67.44 0 top
R1  48.01,49.02 270 top
R2  33.66,13.46 90 top
R3  34.92,28.7 180 top
R4  43.81,13.46 90 top
R5  45.09,28.7 180 top
R6  53.98,13.46 90 top
R7  55.24,28.7 180 top
R8  64.14,13.46 90 top
R9  65.41,28.7 180 top
R10  74.3,13.46 90 top
R11  75.56,28.7 180 top
R12  84.45,13.46 90 top
R13  85.72,28.7 180 top
R14  22.86,64.9 180 top
R15  20.32,67.44 90 top
R16  27.94,64.9 180 top
R17  25.4,67.44 90 top
R18  33.02,64.9 180 top
R19  30.48,67.44 90 top
R20  46.35,64.9 180 top
R21  43.81,67.44 90 top
R22  51.44,64.9 180 top
R23  48.9,67.44 90 top
R24  56.52,64.9 180 top
R25  53.98,67.44 90 top
R26  69.85,64.9 180 top
R27  67.31,67.44 90 top
R28  74.93,64.9 180 top
R29  72.39,67.44 90 top
R30  80.01,64.9 180 top
R31  77.47,67.44 90 top
R32  93.34,64.9 180 top
R33  90.81,67.44 90 top
R34  98.42,64.9 180 top
R35  95.89,67.44 90 top
R36  103.5,64.9 180 top
R37  100.97,67.44 90 top
R38  19.81,12.7 90 top
R39  46.23,49.02 270 top
R40  43.18,49.02 270 top
R41  38.86,44.2 90 top
R42  37.08,44.2 90 top
SW1  39.88,36.83 180 top
U1  60.96,46.1 90 top
U2  21.59,24.89 270 top
U$1  [ESD_10.00]  97.54,7.37 0 top
X1  2.54,24.89 270 top
X2  25.4,78.87 180 top
X3  48.9,78.87 180 top
X4  72.39,78.87 180 top
X5  95.89,78.87 180 top
X6  61.59,3.3 0 top
X7  113.67,28.7 90 top
X8  113.67,43.94 90 top
X9  113.67,59.18 90 top
Y2  53.72,36.7 135 top

### Tracks (layer width: path | path; a pad name or v marks a point on that pad's centre or on a via)
+3V3  (via drill 0.35)
  Top 0.305: U1.19 68.5,43.35 68.83,43.69 69.84,43.69 C7.1 71.69,43.7 C9.1 | U1.32 69.02,49.85 C6.1 | FB.1 63.25,35.45 C10.1 | U1.64 52.27,42.35 C8.1 | C8.1 C12.1 | R38.2 19.45,13.88 C2.1 | C11.1 55.1,54.61 C5.1 55.1,53.1 56.41,51.79 U1.48 | R3.2 34.11,27.87 v34.29,27.69 | v84.84,27.69 84.84,28.63 R13.2 | R5.2 44.27,27.76 v44.2,27.69 | R7.2 54.43,27.76 v54.36,27.69 | R9.2 64.59,27.76 v64.52,27.69 | R11.2 74.75,27.76 v74.68,27.69 | C8.1 52.31,40.64 56.98,40.64 U1.1
  Top 0.508: R41.2 R42.2 v33.84,48.26 2.54,48.26 | C6.1 69.85,52.83 72.14,55.12 v78.23,55.12 99.82,55.12 106.68,61.98 113.36,61.98 X9.3 | C10.1 68.33,30.37 v68.33,27.69 | 55.1,54.61 v33.78,54.61
  Top 0.61: C9.1 78.18,44.4 v78.23,44.45 | JP3.1 12.56,41.52 C12.1
  Top 0.813: X9.3 115.84,61.7 117.86,59.69 117.86,46.48 | X7.3 116.06,31.22 117.86,33.02 117.86,46.48 | X8.3 117.83,46.46 117.86,46.48 | JP1.5 4.19,61.09 2.54,59.44 2.54,48.26 2.54,38.35 2.54,20.07 5.46,17.14 v15.24,17.14
  Top 1.016: 2.54,38.35 JP3.2 JP3.1
  Bottom 0.508: v33.78,54.61 33.78,48.31 v33.84,48.26
  Bottom 0.61: v78.23,55.12 v78.23,44.45 78.23,27.69
  Bottom 1.016: v17.78,19.69 24,19.69 32,27.69 v34.29,27.69 v44.2,27.69 v54.36,27.69 v68.33,27.69 | 17.78,18.29 v17.78,17.14 v15.24,17.14 v15.24,19.69 v17.78,19.69 | 17.78,18.29 v17.78,19.69 | v16.51,17.14 v16.51,19.69 | v15.24,18.41 17.65,18.41 17.78,18.29 | v64.52,27.69 v68.33,27.69 | v84.84,27.69 78.23,27.69 v68.33,27.69 | v74.68,27.69 v68.33,27.69
  other vias: 17.78,18.41 16.51,18.41
  pour Top (isolate 0.61): 19.94,15.8 19.94,23.29 17.27,23.29 16.38,22.4 14.48,22.4 14.48,16.05 15.11,15.42 19.56,15.42
B1
  Top 0.305: U1.8 60.71,39.14 59.46,37.9 59.46,33.21 56.48,30.23 37.26,30.23 R3.1
  Top 0.61: OK1.5 35.74,26.18 R3.1
B2
  Top 0.305: U1.9 61.21,39 59.92,37.71 59.92,32.77 56.9,29.75 53.4,29.75 52.35,28.7 R5.1
  Top 0.61: OK2.5 45.9,26.18 R5.1
B3
  Top 0.305: U1.10 61.71,38.85 60.38,37.52 60.38,32 57.08,28.7 R7.1
  Top 0.61: OK3.5 56.06,26.18 R7.1
B4
  Top 0.305: U1.11 62.21,38.59 60.96,37.34 60.96,32.51 62.99,30.48 64.52,30.48 66.22,28.78 R9.1
  Top 0.61: OK4.5 66.22,26.18 R9.1
B5
  Top 0.305: U1.14 63.71,38.65 69.09,33.27 73.41,33.27 76.38,30.3 R11.1
  Top 0.61: OK5.5 76.38,26.18 R11.1
B6
  Top 0.305: U1.15 64.21,38.91 69.09,34.04 83.06,34.04 86.54,30.55 R13.1
  Top 0.61: OK6.5 86.54,26.18 R13.1
CDIR1
  Top 0.406: R17.1 27.19,68.41 Q2.3
  Top 0.508: Q2.3 X2.2
CDIR2
  Top 0.406: R23.1 50.69,68.41 Q5.3
  Top 0.508: Q5.3 X3.2
CDIR3
  Top 0.406: R29.1 74.18,68.41 Q8.3
  Top 0.508: Q8.3 X4.2
CDIR4
  Top 0.406: R35.1 97.67,68.41 Q11.3
  Top 0.508: Q11.3 X5.2
CEN1
  Top 0.406: R19.1 32.27,68.41 Q3.3
  Top 0.508: Q3.3 X2.1
CEN2
  Top 0.406: R25.1 55.77,68.41 Q6.3
  Top 0.508: Q6.3 X3.1
CEN3
  Top 0.406: R31.1 79.26,68.41 Q9.3
  Top 0.508: Q9.3 X4.1
CEN4
  Top 0.406: R37.1 102.75,68.41 Q12.3
  Top 0.508: Q12.3 X5.1
CPUL1
  Top 0.406: R15.1 22.11,68.41 Q1.3
  Top 0.508: Q1.3 X2.3
CPUL2
  Top 0.406: R21.1 45.6,68.41 Q4.3
  Top 0.508: Q4.3 X3.3
CPUL3
  Top 0.406: R27.1 69.1,68.41 Q7.3
  Top 0.508: Q7.3 X4.3
CPUL4
  Top 0.406: R33.1 92.59,68.41 Q10.3
  Top 0.508: Q10.3 X5.3
DIR1
  Top 0.305: U1.43 59.71,56.28 57.91,58.08 35.57,58.08 R16.1
DIR2
  Top 0.305: U1.40 61.21,57.48 58.49,60.2 54.86,60.2 52.25,62.81 R22.1
DIR3
  Top 0.305: U1.37 62.71,57.38 65.28,59.94 72.9,59.94 75.75,62.79 R28.1
DIR4
  Top 0.305: U1.34 64.21,56.28 65.55,57.62 91.97,57.62 R34.1
EN1
  Top 0.305: U1.42 60.21,56.68 58.09,58.8 39.93,58.8 R18.1
EN2
  Top 0.305: R24.1 57.33,64.81 61.71,60.43 U1.39
EN3
  Top 0.305: U1.36 63.21,57.08 65.31,59.18 76.96,59.18 80.83,63.04 R30.1
EN4
  Top 0.305: R36.1 96.32,56.9 65.79,56.9 64.71,55.82 U1.33
GND  (via drill 0.35)
  Top 0.305: U1.18 68.4,42.85 69.1,42.15 C7.2 71.69,42.15 C9.2 | U1.31 69.64,49.35 C6.2 70.81,50.09 72.1,51.39 C4.2 | U1.12 62.71,38.33 61.84,37.45 C10.2 | C17.2 53.9,35.3 Y2.4 | Y2.2 52.36,39.26 C16.2 | 56.69,53.68 C5.2 56.9,53.72 | LED3.C 41.66,50.29 42.42,51.05 43.72,51.05 | 43.72,51.05 LED2.C | U1.63 51.65,42.85 C8.2 C12.2 | C13.2 43.48,39.08 43.43,39.08 SW1.3 | LED1.C 21.2,13.89 C2.2 | U1.47 57.71,53.03 57.02,53.72 56.9,53.72 | C11.2 56.9,54.88 56.9,53.72 | Q1.2 23.81,67.5 v23.88,67.56 | v104.16,67.55 104.45,67.25 Q12.2 | Q2.2 28.89,67.5 v28.96,67.56 | Q3.2 33.97,67.5 v34.04,67.56 | Q4.2 47.3,67.5 v47.24,67.56 | Q5.2 52.38,67.5 v52.32,67.56 | Q6.2 57.47,67.5 v57.4,67.56 | Q7.2 70.8,67.5 v70.87,67.56 | Q8.2 75.88,67.5 v75.95,67.56 | Q9.2 80.96,67.5 v81.03,67.56 | Q10.2 94.3,67.37 v94.49,67.56 | Q11.2 99.38,67.37 v99.57,67.56 | 43.72,51.05 47.5,51.05 v47.75,50.8
  Top 0.508: Y2.2 54.36,38.89 v54.36,39.12 | C16.2 52.96,39.88 v53.09,39.88 | C17.2 54.36,33.4 v54.36,33.27 | Y2.4 52.83,34.26 v52.83,33.27 | C10.2 61.84,34.4 v61.72,34.29 | C7.2 v69.85,40.89 | C9.2 72.44,41.4 v74.17,41.4 | 70.81,50.09 v70.87,50.09 | C4.2 72.47,51.31 v73.91,51.31 | C11.2 56.77,55.12 v57.53,54.36 | C12.2 49.16,43.07 v49.02,42.93 | R1.1 47.75,50.09 v47.75,50.8
  Top 0.61: OK1.4 40.57,25.73 v40.64,25.65 | v50.8,25.65 48.97,25.65 OK2.4 | v60.96,25.65 59.13,25.65 OK3.4 | v91.44,25.65 89.61,25.65 | 89.61,25.65 OK6.4 | OK5.4 81.21,25.73 v81.28,25.65 | OK4.4 71.3,25.73 v71.37,25.65 | v74.17,41.4 80.01,41.4 89.61,31.8 89.61,25.65
  Top 1.016: X1.2 10.21,24.94 U2.2 | C1.2 21.7,32.51 25.51,36.32 40.68,36.32 43.43,39.08
  Bottom 0.305: 104.14,67.56 v104.16,67.55
  Bottom 0.508: 47.46,39.08 47.5,39.12
  Bottom 0.61: v40.64,25.65 v50.8,25.65 v60.96,25.65 v71.37,25.65 v81.28,25.65 v91.44,25.65
  Bottom 0.813: JP1.6 10.92,67.56 v23.88,67.56 v28.96,67.56 v34.04,67.56 v47.24,67.56 v52.32,67.56 v57.4,67.56 | v57.4,67.56 61.72,67.56 | 61.72,67.56 v70.87,67.56 | 61.72,67.56 61.72,57.4 | v57.4,67.56 v70.87,67.56 | v70.87,67.56 v75.95,67.56 v81.03,67.56 v94.49,67.56 v99.57,67.56 104.14,67.56
  Bottom 1.016: SW1.3 47.46,39.08 | 2.54,45.97 2.54,24.13 4.57,22.1 7.37,22.1 X1.2 | 2.54,45.97 2.54,61.72 4.45,63.63 JP1.6 | v104.16,67.55 109.73,61.98 109.73,51.82 | X9.1 110,51.54 109.73,51.82 | 109.73,51.82 109.73,40.21 X8.1 116.84,33.1 116.84,24.26 X7.1 | 2.54,45.97 JP3.8 JP3.7
  pour Top (isolate 0.61): 20.7,33.83 20.7,26.72 19.94,25.96 17.4,25.96 16.13,27.23 15.11,27.23 14.86,26.97 14.86,22.91 15.11,22.66 16.13,22.66 17.4,23.93 19.94,23.93 20.45,23.42 20.45,16.05 25.78,16.05 25.78,33.83
  pour Bottom (isolate 0.61): 46.99,54.86 46.99,35.05 50.04,32 73.91,32 76.96,35.05 76.96,54.86 73.91,57.91 50.04,57.91
GND1
  Top 0.61: OK1.2 36.2,10.92 X6.2
GND2
  Top 0.61: OK2.2 46.35,10.92 X6.4
GND3
  Top 0.61: OK3.2 56.52,10.92 X6.6
GND4
  Top 0.61: OK4.2 66.67,10.92 X6.8
GND5
  Top 0.61: OK5.2 76.83,10.92 X6.10
GND6
  Top 0.61: OK6.2 87,10.92 X6.12
I2C_SCL
  Top 0.254: 52.83,44.39 40.58,44.39 40.39,44.2 37.85,44.2 37.08,43.43 R42.1
  Top 0.305: U1.61 53.43,43.85 52.89,44.39 52.83,44.39 | R42.1 13.01,43.38 11.68,44.7 8.13,44.7 JP3.6
I2C_SDA
  Top 0.305: U1.62 52.66,43.35 52.07,43.94 41.91,43.94 41.15,43.18 39.06,43.18 R41.1 37.65,42.16 8.13,42.16 JP3.4
IN1
  Top 0.61: R2.1 X6.1
IN2
  Top 0.61: R4.1 X6.3
IN3
  Top 0.61: R6.1 X6.5
IN4
  Top 0.61: R8.1 X6.7
IN5
  Top 0.61: R10.1 X6.9
IN6
  Top 0.61: R12.1 X6.11
IO0
  Top 0.305: U1.20 68.23,43.85 69.85,45.47 90.68,45.47 109.98,26.16 110,26.14 X7.2
IO1
  Top 0.305: U1.21 68.09,44.35 69.66,45.92 102.16,45.92 106.7,41.38 X8.2
IO2
  Top 0.305: U1.22 67.94,44.85 69.46,46.37 69.47,46.38 95.91,46.38 105.16,55.63 106.15,56.62 X9.2
LD1
  Top 0.305: U1.58 49.08,45.35 R39.2
LD2
  Top 0.305: U1.59 45.57,44.85 43.18,47.24 R40.2
N$1
  Top 0.305: U1.13 63.21,37.63 FB.2
N$2
  Top 0.305: U1.30 67.99,48.85 68.83,48.01 71.96,48.01 C4.1
N$4  (via drill 0.35)
  Top 0.305: U1.60 56.8,44.35 v56.9,44.45 | v49.02,47.5 48.72,47.5 R1.2
  Bottom 0.305: v56.9,44.45 52.07,44.45 v49.02,47.5
N$6
  Top 0.305: U1.5 59.21,39.52 57.44,37.75 54.9,37.75 53.48,36.32 52.9,36.32 Y2.3 52.34,37.11 C16.1
N$7
  Top 0.305: U1.6 59.71,39.14 57.1,36.53 Y2.1 55.1,36.29 C17.1
N$8
  Top 0.61: R2.2 OK1.1
N$9
  Top 0.406: R14.2 21.91,65.03 Q1.1
N$10
  Top 0.254: R40.1 41.66,48.31 LED3.A
N$11
  Top 0.254: R39.1 44.7,48.31 LED2.A
N$12
  Top 0.61: R4.2 OK2.1
N$13
  Top 0.406: R32.2 92.39,65.03 Q10.1
N$14
  Top 0.406: R16.2 26.99,65.03 Q2.1
N$15
  Top 0.305: R38.1 21.1,11.89 LED1.A
N$16
  Top 0.61: R6.2 OK3.1
N$17
  Top 0.813: X1.1 12.07,27.43 D1.A
N$19
  Top 0.406: R18.2 32.07,65.03 Q3.1
N$20
  Top 0.61: R8.2 OK4.1
N$24
  Top 0.61: R10.2 OK5.1
N$25
  Top 0.406: R20.2 45.41,65.03 Q4.1
N$28
  Top 0.61: R12.2 OK6.1
N$30
  Top 0.406: R22.2 50.48,65.03 Q5.1
N$33
  Top 0.406: R34.2 97.47,65.03 Q11.1
N$34
  Top 0.406: R24.2 55.56,65.03 Q6.1
N$38
  Top 0.406: R26.2 68.9,65.03 Q7.1
N$42
  Top 0.406: R28.2 73.98,65.03 Q8.1
N$46
  Top 0.406: R30.2 79.06,65.03 Q9.1
N$49
  Top 0.406: R36.2 102.56,65.03 Q12.1
NRST  (via drill 0.35)
  Top 0.305: U1.7 60.2,40.42 v60.2,41.91 | C13.1 43.48,34.58 SW1.1
  Bottom 0.305: v60.2,41.91 52.87,34.58 SW1.1
  Bottom 0.508: SW1.1 40.62,37.08 30.99,37.08 9.4,58.67 7.11,58.67 JP1.4
PUL1
  Top 0.305: R14.1 31.17,57.4 57.66,57.4 59.21,55.85 U1.44
PUL2
  Top 0.305: U1.41 60.71,57.08 58.36,59.44 50.55,59.44 47.17,62.81 R20.1
PUL3
  Top 0.305: R26.1 70.67,62.79 68.58,60.71 65.02,60.71 62.21,57.89 U1.38
PUL4
  Top 0.305: U1.35 63.71,56.68 65.53,58.5 87.76,58.5 R32.1
RX  (via drill 0.35)
  Top 0.305: U1.17 69.6,39.41 v69.6,36.07
  Bottom 0.305: v69.6,36.07 65.28,31.75 29.21,31.75 17.53,43.43 JP3.5
SWCLK
  Top 0.305: U1.49 51.89,49.85 48.27,53.47 JP1.2
SWDIO
  Top 0.305: JP1.3 53.72,56.01 54.1,56.39 57.4,56.39 58.21,55.58 U1.46
SWO
  Top 0.305: JP1.1 38.73,50.93 39.88,52.07 47.75,52.07 52.97,46.85 U1.55
TX  (via drill 0.35)
  Top 0.305: U1.16 64.71,39.68 v69.6,34.8
  Bottom 0.305: v69.6,34.8 65.79,30.99 28.45,30.99 18.67,40.77 9.53,40.77 JP3.3
V1
  Top 0.508: R15.2 17.78,70.79 X2.4 17.78,76.33 19.05,77.6 25.4,77.6 | 25.4,77.6 29.21,77.6 30.48,76.33 R19.2 | R17.2 25.4,77.6
V2
  Top 0.508: R21.2 41.27,70.79 X3.4 41.27,76.33 42.55,77.6 48.9,77.6 | R25.2 53.98,76.33 52.7,77.6 48.9,77.6 | R23.2 48.9,77.6
V3
  Top 0.508: R27.2 64.77,70.79 X4.4 64.77,76.33 66.04,77.6 72.39,77.6 | R31.2 77.47,76.33 76.2,77.6 72.39,77.6 | R29.2 72.39,77.6
V4
  Top 0.508: R33.2 88.27,70.79 X5.4 88.27,76.33 89.53,77.6 95.89,77.6 | R37.2 100.97,76.33 99.69,77.6 95.89,77.6 | R35.2 95.89,77.6
VCC  (via drill 0.35)
  Top 1.016: D1.C 16.5,30.98 v16.64,31.12
  Bottom 1.016: 16.51,29.85 v15.37,29.85 v15.37,32.38 v17.91,32.38 v17.91,29.85 16.51,29.85 | v15.37,31.12 v17.91,31.12 | v16.64,32.38 16.64,29.97 16.51,29.85
  other vias: 16.64,29.85
  pour Top (isolate 0.813): 20.07,34.09 20.07,26.59 17.4,26.59 16.51,27.48 14.61,27.48 14.61,33.83 15.24,34.47 19.68,34.47

### Text on the board
tPlace: VCC | PUL | DIR | EN | VCC | PUL | DIR | EN | VCC | PUL | DIR | EN | VCC | PUL | DIR | EN | St-Link | GND | 3V3 | DRIVER 1 | DRIVER 2 | DRIVER 3 | DRIVER 4 | 3v3 | NRST | SWDIO | S | SWCLK | SWO | Serial | gnd | I2C | GND | GND | 3v3 | SCL | RX | SDA | TX | RESET | S | 3V3 | 3V3 | Stepper Motor Control Board | gnd | 3v3 | + | S | - | gnd | VIN | IN | gnd | IN | gnd | IN | gnd | IN | gnd | IN | gnd | IN | gnd | Vin: 6V/28V | v0.0
bPlace: VCC | PUL | VCC | PUL | VCC | PUL | VCC | PUL | DIR | DIR | DIR | DIR | EN | EN | EN | EN | + | - | IN | gnd | IN | gnd | IN | gnd | IN | gnd | IN | gnd | IN | gnd